# Altium schematic sheet Microcontroller.SchDoc
size A
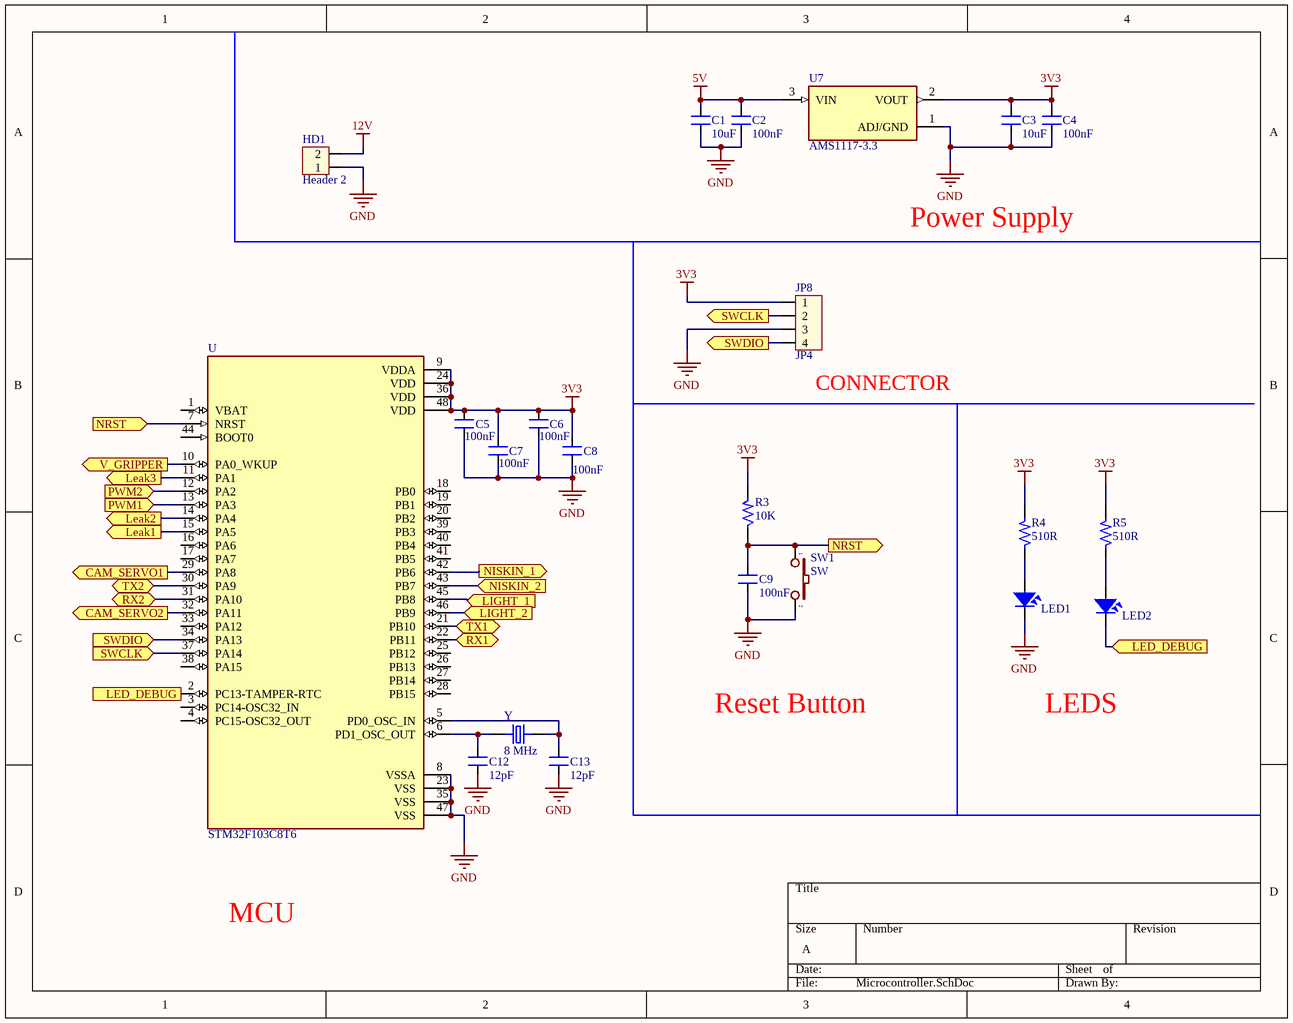
[diagram p0: Microcontroller.SchDoc]

## Parts
C1  10uF  [SM-0805]
C2  100nF  [SM-0805]
C3  10uF  [SM-0805]
C4  100nF  [SM-0805]
C5  100nF  [SM-0805]
C6  100nF  [SM-0805]
C7  100nF  [SM-0805]
C8  100nF  [SM-0805]
C9  100nF  [SM-0805]
C12  12pF  [SM-0805]
C13  12pF  [SM-0805]
HD1  Header 2  [HED2]
JP8  JP4  [JP4]
LED1  LED SMD  [SM-LED-0805-Blue]  (value not drawn)
LED2  LED SMD  [SM-LED-0805-Yellow]  (value not drawn)
R3  10K  [SM-RES-0805]
R4  510R  [SM-RES-0805]
R5  510R  [SM-RES-0805]
SW1  SW  [SW2]
U  STM32F103C8T6  [QFP50P900X900X160-48N]
U7  AMS1117-3.3  [SOT229P700X180-4N]
Y  8 MHz  [XTAL_ECS-120.003-18-5P-TR]

## Ports
CAM_SERVO1 (out), CAM_SERVO2 (out), Leak1 (out), Leak2 (out), Leak3 (out), LED_DEBUG (in), LED_DEBUG (out), LIGHT_1 (in), LIGHT_2 (in), NISKIN_1 (out), NISKIN_2 (in), NRST (in), NRST (out), PWM1 (in), PWM2 (in), RX1 (bidir), RX2 (bidir), SWCLK (in), SWCLK (out), SWDIO (in), SWDIO (out), TX1 (bidir), TX2 (bidir), V_GRIPPER (out)

## Nets
3V3: C3.2 C4.2 C5.2 C6.2 C7.2 C8.2 JP8.1 R3.2 R4.2 R5.2 U.9(VDDA) U.24(VDD) U.36(VDD) U.48(VDD) U7.2(VOUT)
5V: C1.2 C2.2 U7.3(VIN)
12V: HD1.2
GND: C1.1 C2.1 C3.1 C4.1 C5.1 C6.1 C7.1 C8.1 C9.1 C12.1 C13.1 HD1.1 JP8.3 LED1.2 SW1.2 U.8(VSSA) U.23(VSS) U.35(VSS) U.47(VSS) U7.1(ADJ/GND)
CAM_SERVO1: U.29(PA8) ; port CAM_SERVO1
CAM_SERVO2: U.32(PA11) ; port CAM_SERVO2
Leak1: U.15(PA5) ; port Leak1
Leak2: U.14(PA4) ; port Leak2
Leak3: U.11(PA1) ; port Leak3
LED_DEBUG: LED2.2 U.2(PC13-TAMPER-RTC) ; port LED_DEBUG
LIGHT_1: U.45(PB8) ; port LIGHT_1
LIGHT_2: U.46(PB9) ; port LIGHT_2
NISKIN_1: U.42(PB6) ; port NISKIN_1
NISKIN_2: U.43(PB7) ; port NISKIN_2
NRST: C9.2 R3.1 SW1.1 U.7(NRST) ; port NRST
PWM1: U.13(PA3) ; port PWM1
PWM2: U.12(PA2) ; port PWM2
RX1: U.22(PB11) ; port RX1
RX2: U.31(PA10) ; port RX2
SWCLK: JP8.2 U.37(PA14) ; port SWCLK
SWDIO: JP8.4 U.34(PA13) ; port SWDIO
TX1: U.21(PB10) ; port TX1
TX2: U.30(PA9) ; port TX2
V_GRIPPER: U.10(PA0_WKUP) ; port V_GRIPPER
NetC12_2: C12.2 U.6(PD1_OSC_OUT) Y.1
NetC13_2: C13.2 U.5(PD0_OSC_IN) Y.2
NetLED1_1: LED1.1 R4.1
NetLED2_1: LED2.1 R5.1

Not connected (* = marked no-connect by the designer): U 1(VBAT) 3(PC14-OSC32_IN) 4(PC15-OSC32_OUT) 16(PA6) 17(PA7) 18(PB0) 19(PB1) 20(PB2) 25(PB12) 26(PB13) 27(PB14) 28(PB15) 33(PA12) 38(PA15) 39(PB3) 40(PB4) 41(PB5) 44(BOOT0)

## Notes on the sheet
- Power Supply
- (near JP8) CONNECTOR
- Reset Button
- LEDS
- MCU

## Library data of the parts
C1-C9 C12 C13 = CM: Cap SMD; Value: 103
HD1 = Hed2: Header 2 (Green); Value: Header 2
JP8 = Con4: Connector 4; Value: Connector 4
LED1 LED2 = LED-SMD-0805
R3-R5 = R: Resistor 1/4W; Value: R1/4W - 1K
SW1 = SW2: Switch button 2 pin; Value: SW chip 2 pin
U = STM32F103C8T6: ARMÂ® CortexÂ®-M3 STM32F1 Microcontroller IC 32-Bit 72MHz 64KB _64K x 8_ FLASH; MF: STMicroelectronics; Price: None; Package: LQFP-48 STMicroelectronics; Value: *; MP: STM32F103C8T6; Availability: Unavailable; SnapEDA_Link: https://www.snapeda.com/parts/STM32F103C8T6/STMicroelectronics/view-part/52195/?ref=snap
U7 = AMS1117-3.3: Sot223/Pkg 1-Amp 3.3-Volt Low Drop Out Voltage Regulatator; MF: Advanced Monolithic Systems; Price: None; Package: None; Value: *; MP: AMS1117-3.3; Availability: Unavailable; SnapEDA_Link: https://www.snapeda.com/parts/AMS1117-3.3/Advanced%20Monolithic%20Systems/view-part/53450/?ref=snap
Y = ECS-120.003-18-5P-TR: MF: ECS International; Package: HC49/US ECS International; Value: *; SnapEDA_Link: https://www.snapeda.com/parts/ECS-120.003-18-5P-TR/ECS%20International/view-part/2547635/?ref=snap; Price: None; MP: ECS-120.003-18-5P-TR; Availability: Unavailable